# Altium schematic sheet Connectors.SchDoc
size A4; SheetNumber: 2; SheetTotal: 2
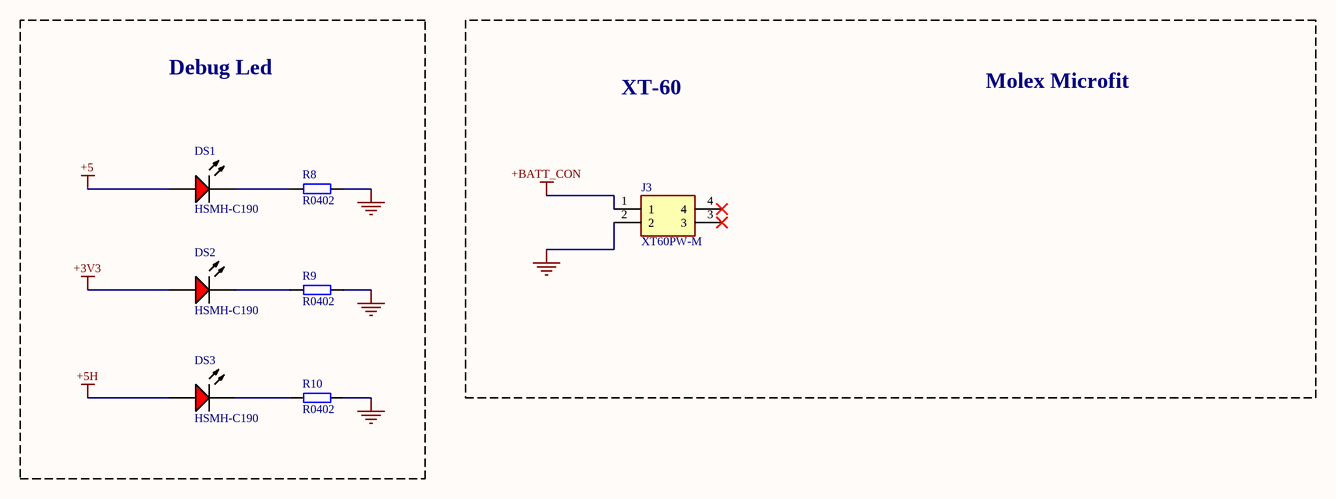
[diagram p0: Connectors.SchDoc]

## Parts
DS1  HSMH-C190  [AVAG-HSMX-C190_V]
DS2  HSMH-C190  [AVAG-HSMX-C190_V]
DS3  HSMH-C190  [AVAG-HSMX-C190_V]
J3  XT60PW-M  [XT60PWM]
R8  R0402  [RES_0402]
R9  R0402  [RES_0402]
R10  R0402  [RES_0402]

## Blocks framed on the sheet
Debug Led: DS1-DS3 R8-R10

## Nets
+3V3: DS2.1(A)
+5: DS1.1(A)
+5H: DS3.1(A)
+BATT_CON: J3.1
GND: J3.2 R8.2 R9.2 R10.2
NetDS1_2: DS1.2(K) R8.1
NetDS2_2: DS2.2(K) R9.1
NetDS3_2: DS3.2(K) R10.1

Not connected (* = marked no-connect by the designer): J3 3* 4*

## Notes on the sheet
- XT-60
- Molex Microfit

## Library data of the parts
DS1-DS3 = CMP-007-00014-2: LED Uni-Color Red, 65 mW, 20 mA, -40 to 85 degC, 2-Pin SMD, RoHS, Tape and Reel; Manufacturer: Avago; Nominal Vf: 1.8V; Luminous Intensity: 17mcd; Power: 78mW; Forward Current: 20mA; Lens Style: Diffused; Viewing Angle: 170degrees; Package Quantity: 4000; Colour: Red; Manufacturer URL: http://www.avagotech.com/; Min Operating Temperature: -40°C; Datasheet URL: http://docs.avagotech.com/docs/AV02-0551EN; RoHS Compliant: True; Forward Voltage: 1.8V; Pins: 2; Max Operating Temperature: 85°C; Packaging: TapeandReel; Package Reference: HSMX-C190; Datasheet Version: Mar-12; Package Description: 2-Pin Surface Mount Device, Body 1.6 x 0.8 mm, Height 0.9 mm; Case/Package: 0603; Mounting Technology: SM; Illumination Colour: Red
J3 = XT60PW-M: Connector; Manufacturer_Name: Changzou Amass Elec; Datasheet Link: https://www.tme.eu/Document/9b8d0c5eb7094295f3d3112c214d3ade/XT60PW%20SPEC.pdf; Height: 8.4mm; Manufacturer_Part_Number: XT60PW-M
R8-R10 = RES_0402: Resistor SMD 0402; Manufacturer: *; Manufacturer Part Number: *; Distributor Link: *; LCSC: *